# Altium schematic sheet [2]-BLOCK_DIAGRAM.SchDoc
size A4
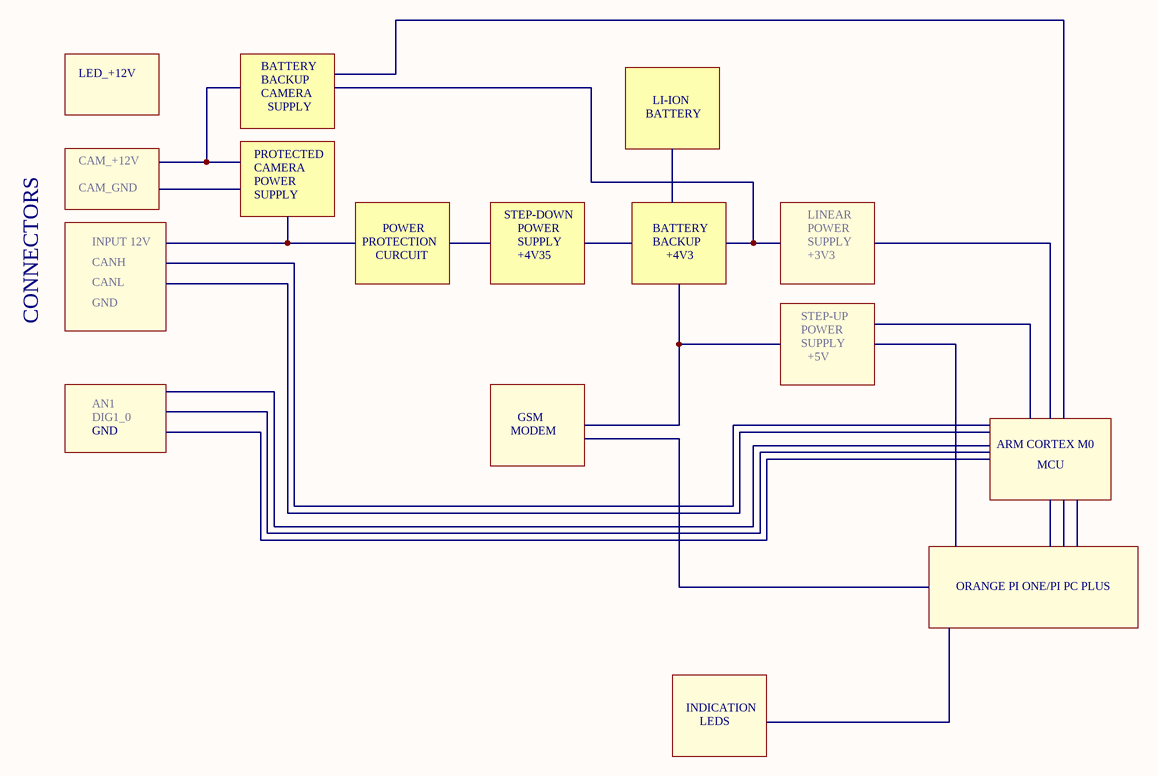
[diagram p0: [2]-BLOCK_DIAGRAM.SchDoc]

## Notes on the sheet
- LED_+12V
- BATTERY
- BACKUP
- CAMERA
- LI-ION
- CAM_+12V
- PROTECTED
- SUPPLY
- CAM_GND
- POWER
- STEP-DOWN
- LINEAR
- INPUT 12V
- CANH
- CANL
- PROTECTION
- CURCUIT
- +4V35
- +4V3
- +3V3
- CONNECTORS
- GND
- STEP-UP
- +5V
- AN1
- DIG1_0
- MODEM
- GSM
- ARM CORTEX M0
- MCU
- ORANGE PI ONE/PI PC PLUS
- INDICATION
- LEDS